# Altium schematic sheet Main.SchDoc
size A4; Author: Author; CompanyName: AGH Racing; Revision: Rev; SheetNumber: 0; SheetTotal: 0; CarNumber: 5; ProjectName: Project Name
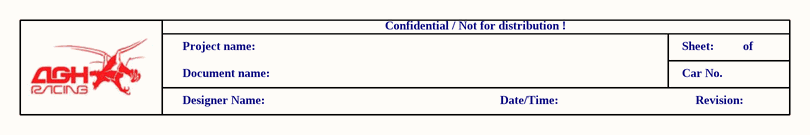
[diagram p0: Main.SchDoc]

## Notes on the sheet
- Confidential / Not for distribution !
- Project name:
- Document name:
- Sheet:
- Car No.
- of
- Designer Name:
- Date/Time:
- Revision: